# EAGLE schematic EPaperDisplayUnit (EAGLE 7.4.0)
GCN: 1.0; PCBNAME: EPaperDisplayUnit; PROJECT: EPaperDisplayUnit

## Sheet 1 of 2
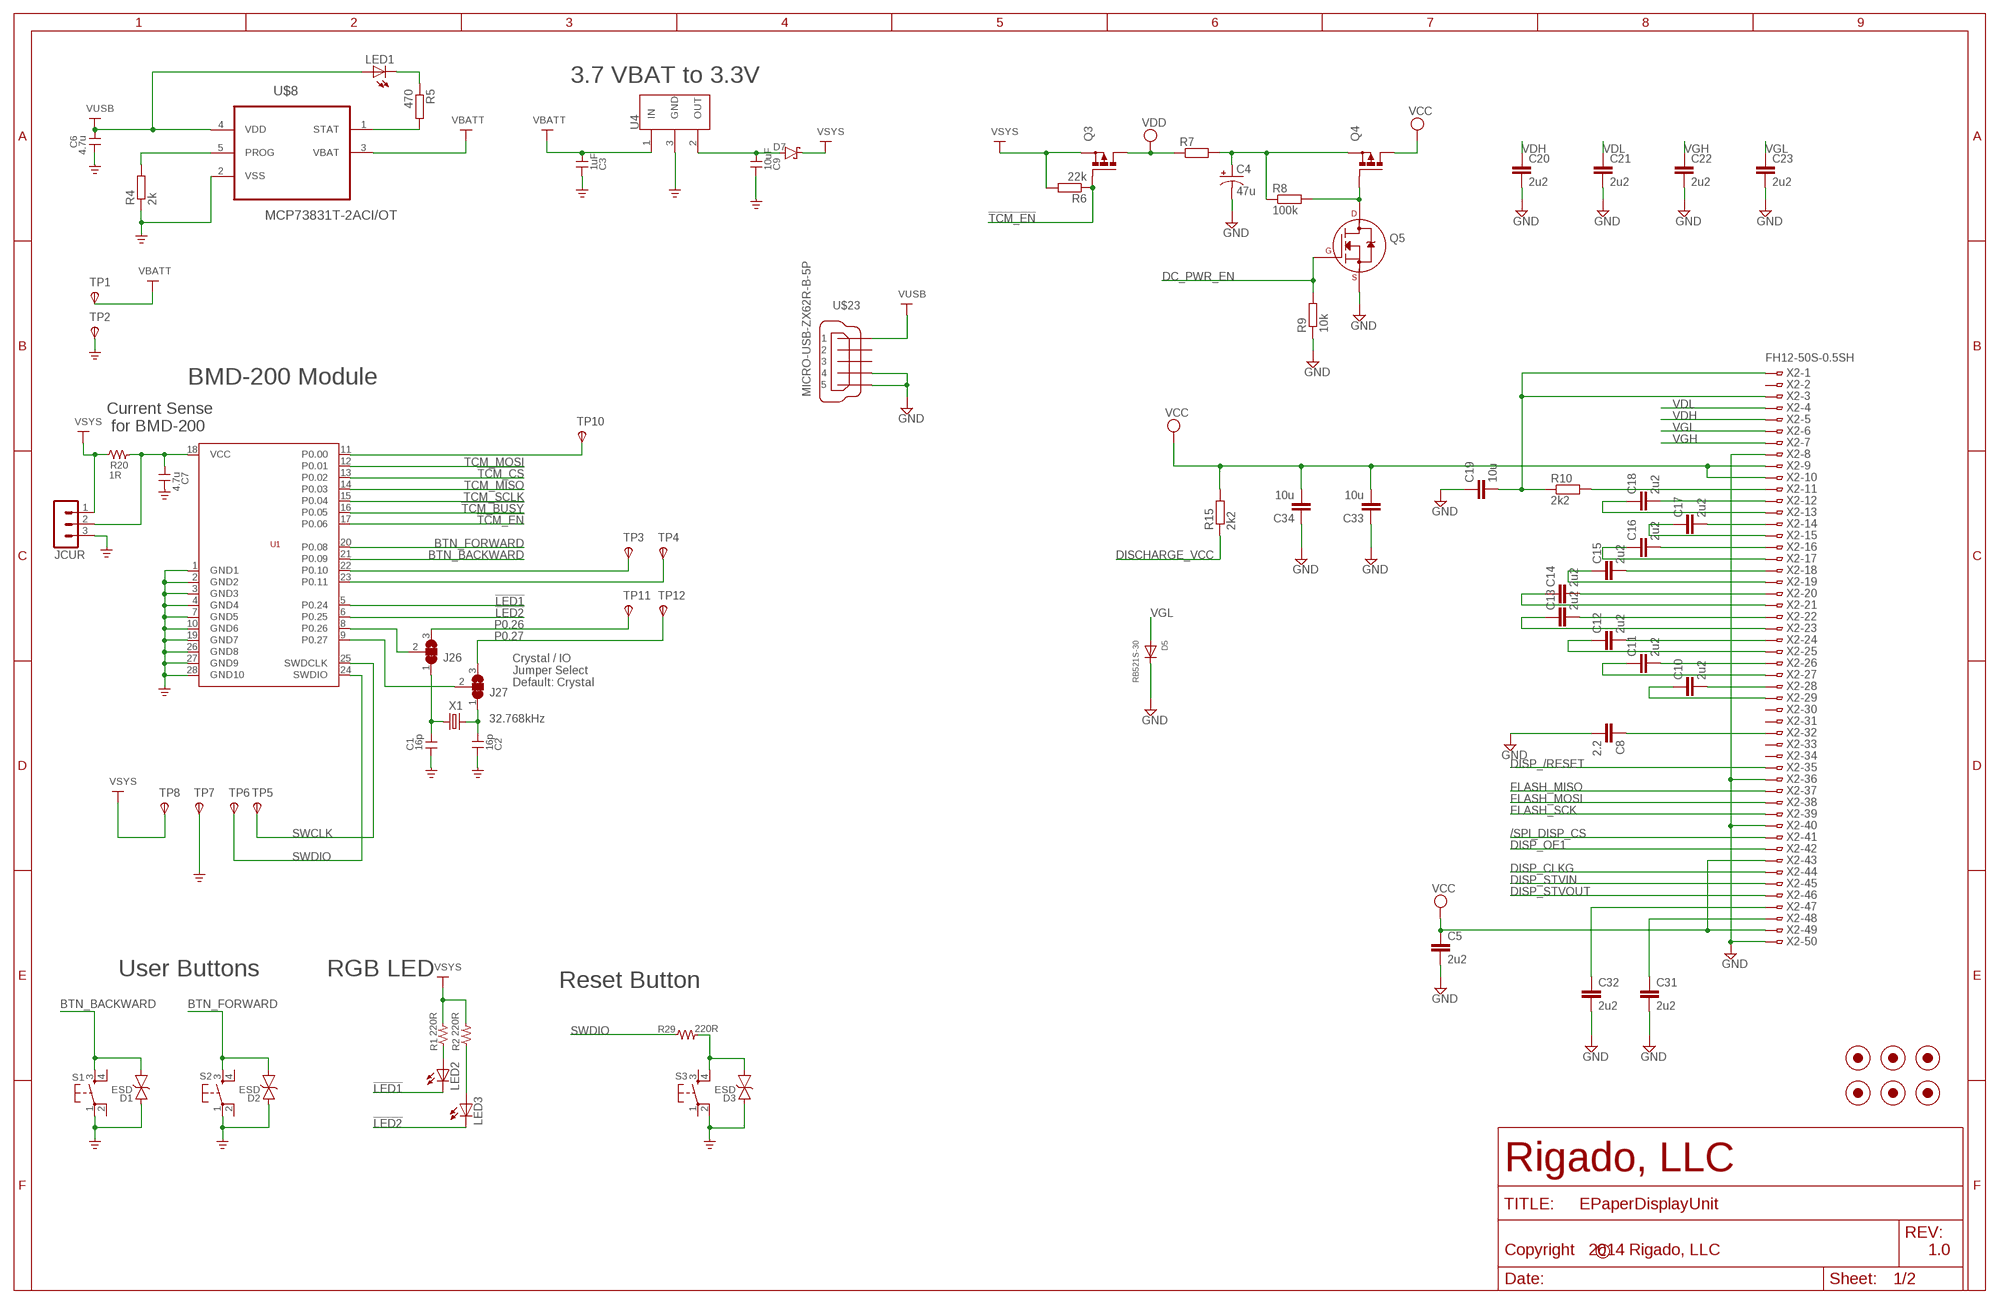
[diagram p0: schematic, sheet 1]

### Parts
C1  16p  C-0402  [SMD0402]
C2  16p  C-0402  [SMD0402]
C3  1uF  C-0402  [SMD0402]
C4  47u  CPOL-USB/3528-21R  [B/3528-21R]
C5  2u2  C-EUC0603  [C0603]
C6  4.7u  C-0603  [SMD0603]
C7  4.7u  C-0603  [SMD0603]
C8  2.2  C-EUC0603  [C0603]
C9  10uF  C-0402  [SMD0402]
C10  2u2  C-EUC1608  [C1608]
C11  2u2  C-EUC1608  [C1608]
C12  2u2  C-EUC1608  [C1608]
C13  2u2  C-EUC1608  [C1608]
C14  2u2  C-EUC1608  [C1608]
C15  2u2  C-EUC1608  [C1608]
C16  2u2  C-EUC1608  [C1608]
C17  2u2  C-EUC1608  [C1608]
C18  2u2  C-EUC1608  [C1608]
C19  10u  C-EUC1608  [C1608]
C20  2u2  C-EUC1608  [C1608]
C21  2u2  C-EUC1608  [C1608]
C22  2u2  C-EUC1608  [C1608]
C23  2u2  C-EUC1608  [C1608]
C31  2u2  C-EUC1608  [C1608]
C32  2u2  C-EUC1608  [C1608]
C33  10u  C-EUC1608  [C1608]
C34  10u  C-EUC1608  [C1608]
D1  ESD  ESDSOD-923  [SOD-923]
D2  ESD  ESDSOD-923  [SOD-923]
D3  ESD  ESDSOD-923  [SOD-923]
D5  RB521S-30  DIODESOD-523  [SOD-523]
D7  D-SCHOTTKY-SOD-123  [SOD-123]
FID1  FIDUCIAL-.04  [FIDUCIAL-.04]
FID2  FIDUCIAL-.04  [FIDUCIAL-.04]
FID3  FIDUCIAL-.04  [FIDUCIAL-.04]
FID4  FIDUCIAL-.04  [FIDUCIAL-.04]
FID5  FIDUCIAL-.04  [FIDUCIAL-.04]
FID6  FIDUCIAL-.04  [FIDUCIAL-.04]
J26  SOLDER_JUMPER_2WAY-TRACE12  [SJ_2WAY_TRACE]
J27  SOLDER_JUMPER_2WAY-TRACE12  [SJ_2WAY_TRACE]
JCUR  MA03-1SMT  [MA03-1-SMT]
LED1  LEDCHIPLED_0603  [CHIPLED_0603]
LED2  LEDCHIP-LED0603  [CHIP-LED0603]
LED3  LEDCHIP-LED0603  [CHIP-LED0603]
Q3  NTR4171PTG  [SOT23]
Q4  NTR4171PTG  [SOT23]
Q5  2N7002_SOT23  [SOT-23]
R1  220R  R-0402  [SMD0402]
R2  220R  R-0402  [SMD0402]
R4  2k  R-EU_R0402  [R0402]
R5  470  R-EU_R0402  [R0402]
R6  22k  R-EU_R0603  [R0603]
R7  R-EU_R0603  [R0603]
R8  100k  R-EU_R0603  [R0603]
R9  10k  R-EU_R0603  [R0603]
R10  2k2  R-EU_R0603  [R0603]
R15  2k2  R-EU_R0603  [R0603]
R20  1R  R-0805  [SMD0805]
R29  220R  R-0402  [SMD0402]
S1  10-XXTL3301-GW  [ESWITCH-TL3301-GW]
S2  10-XXTL3301-GW  [ESWITCH-TL3301-GW]
S3  10-XXTL3301-GW  [ESWITCH-TL3301-GW]
TP1  TPSPAD1-13Y  [P1-13Y]
TP2  TPSPAD1-13Y  [P1-13Y]
TP3  TPSPAD1-13Y  [P1-13Y]
TP4  TPSPAD1-13Y  [P1-13Y]
TP5  TPSPAD1-13Y  [P1-13Y]
TP6  TPSPAD1-13Y  [P1-13Y]
TP7  TPSPAD1-13Y  [P1-13Y]
TP8  TPSPAD1-13Y  [P1-13Y]
TP10  TPSPAD1-13Y  [P1-13Y]
TP11  TPSPAD1-13Y  [P1-13Y]
TP12  TPSPAD1-13Y  [P1-13Y]
U1  BMD-200  [BMD-200]
U4  VREG-SOT23  [SOT-23-3]
U$8  MCP73831T-2ACI/OT  [SOT95P280X145-5N]
U$23  MICRO-USB-ZX62R-B-5P  [ZX62R-B-5P]
X1  32.768kHz  CRYSTAL2SMD  [2SMD]
X2  FH12-50S-0.5SH  [FH12-50S-0.5SH]

### Nets
5V0: C6.1 LED1.A U$8.4(VDD) U$23.1 ; supply symbol labelled VUSB
!LED1: LED2.C U1.5(P0.24)
!LED2: LED3.C U1.6(P0.25)
!TCM_BUSY: U1.16(P0.05) ; also sheet 2
!TCM_CS: U1.13(P0.02) ; also sheet 2
!TCM_EN: Q3.G R6.1 U1.17(P0.06)
/SPI_DISP_CS: X2.41 ; also sheet 2
BTN_BACKWARD: D1.C S1.3(S) U1.21(P0.09)
BTN_FORWARD: D2.C S2.3(S) U1.20(P0.08)
DC_PWR_EN: Q5.1(G) R9.2 ; also sheet 2
DISCHARGE_VCC: R15.1 ; also sheet 2
DISP_/RESET: X2.35 ; also sheet 2
DISP_CLKG: X2.44 ; also sheet 2
DISP_OE1: X2.42 ; also sheet 2
DISP_STVIN: X2.45 ; also sheet 2
DISP_STVOUT: X2.46 ; also sheet 2
FLASH_MISO: X2.37 ; also sheet 2
FLASH_MOSI: X2.38 ; also sheet 2
FLASH_SCK: X2.39 ; also sheet 2
GND [Planes]: C1.1 C2.1 C3.1 C4.- C5.2 C6.2 C7.2 C8.2 C9.1 C19.1 C20.2 C21.2 C22.2 C23.2 C31.2 C32.2 C33.1 C34.1 D1.A D2.A D3.A D5.K(C) JCUR.3 Q5.2(S) R4.1 R9.1 S1.1(P) S2.1(P) S3.2(P1) TP2.TP(PP) TP7.TP(PP) U1.1(GND1) U1.2(GND2) U1.3(GND3) U1.4(GND4) U1.7(GND5) U1.10(GND6) U1.19(GND7) U1.26(GND8) U1.27(GND9) U1.28(GND10) U4.3(GND) U$8.2(VSS) U$23.4 U$23.5 X2.8 X2.36 X2.40 X2.50 ; also sheet 2
N$1: TP10.TP(PP) U1.11(P0.00)
N$3: J26.2 U1.8(P0.26)
N$4: C7.1 JCUR.2 R20.2 U1.18(VCC)
N$6: C9.2 D7.A U4.2(OUT)
N$7: R4.2 U$8.5(PROG)
N$8: LED1.C R5.1
N$9 [Planes]: C8.1 X2.32
N$10: R5.2 U$8.1(STAT)
N$11: Q4.G Q5.3(D) R8.2
N$12: C4.+ Q4.S R7.2 R8.1
N$13: C10.1 X2.29
N$14: C10.2 X2.28
N$15: C11.1 X2.27
N$16: C11.2 X2.26
N$17: C12.1 X2.25
N$18: C12.2 X2.24
N$19: C2.2 J27.1 X1.2
N$20: C1.2 J26.1 X1.1
N$21: C13.1 X2.23
N$22: C13.2 X2.22
N$23: J27.2 U1.9(P0.27)
N$24: C14.1 X2.21
N$25: C14.2 X2.20
N$26: C15.1 X2.19
N$27: C16.1 X2.17
N$28: C16.2 X2.16
N$29: C17.1 X2.15
N$30: C17.2 X2.14
N$31: C18.1 X2.13
N$32: C18.2 X2.12
N$33: LED2.A R1.1
N$34: LED3.A R2.1
N$36: C19.2 R10.1 X2.1 X2.3
N$37: R10.2 X2.11
N$38: TP3.TP(PP) U1.22(P0.10)
N$39: C15.2 X2.18
N$40: TP4.TP(PP) U1.23(P0.11)
N$47: D3.C R29.2 S3.4(S1)
N$48: R29.1
P0.26: J26.3 TP11.TP(PP)
P0.27: J27.3 TP12.TP(PP)
SWCLK: TP5.TP(PP) U1.25(SWDCLK)
SWDIO: TP6.TP(PP) U1.24(SWDIO)
TCM_MISO: U1.14(P0.03) ; also sheet 2
TCM_MOSI: U1.12(P0.01) ; also sheet 2
TCM_SCLK: U1.15(P0.04) ; also sheet 2
VBATT: C3.2 TP1.TP(PP) U4.1(IN) U$8.3(VBAT)
VCC: C5.1 C33.2 C34.2 Q4.D R15.2 X2.9 X2.10 X2.43 X2.49
VDD: Q3.D R7.1 ; also sheet 2
VDH: C20.1 X2.5
VDL: C21.1 X2.4
VGH: C22.1 C31.1 X2.7 X2.48
VGL: C23.1 C32.1 D5.A X2.6 X2.47
VSYS: D7.C JCUR.1 Q3.S R1.2 R2.2 R6.2 R20.1 TP8.TP(PP)
Unconnected: S1.2(P1) S1.4(S1) S2.2(P1) S2.4(S1) S3.1(P) S3.3(S) U$23.2 U$23.3 X2.2 X2.30 X2.31 X2.33 X2.34

### Notes on the sheet
- 3.7 VBAT to 3.3V
- BMD-200 Module
- Current Sense
   for BMD-200
- Crystal / IO
  Jumper Select
  Default: Crystal
- User Buttons | RGB LED
- Reset Button
- 1.0

## Sheet 2 of 2
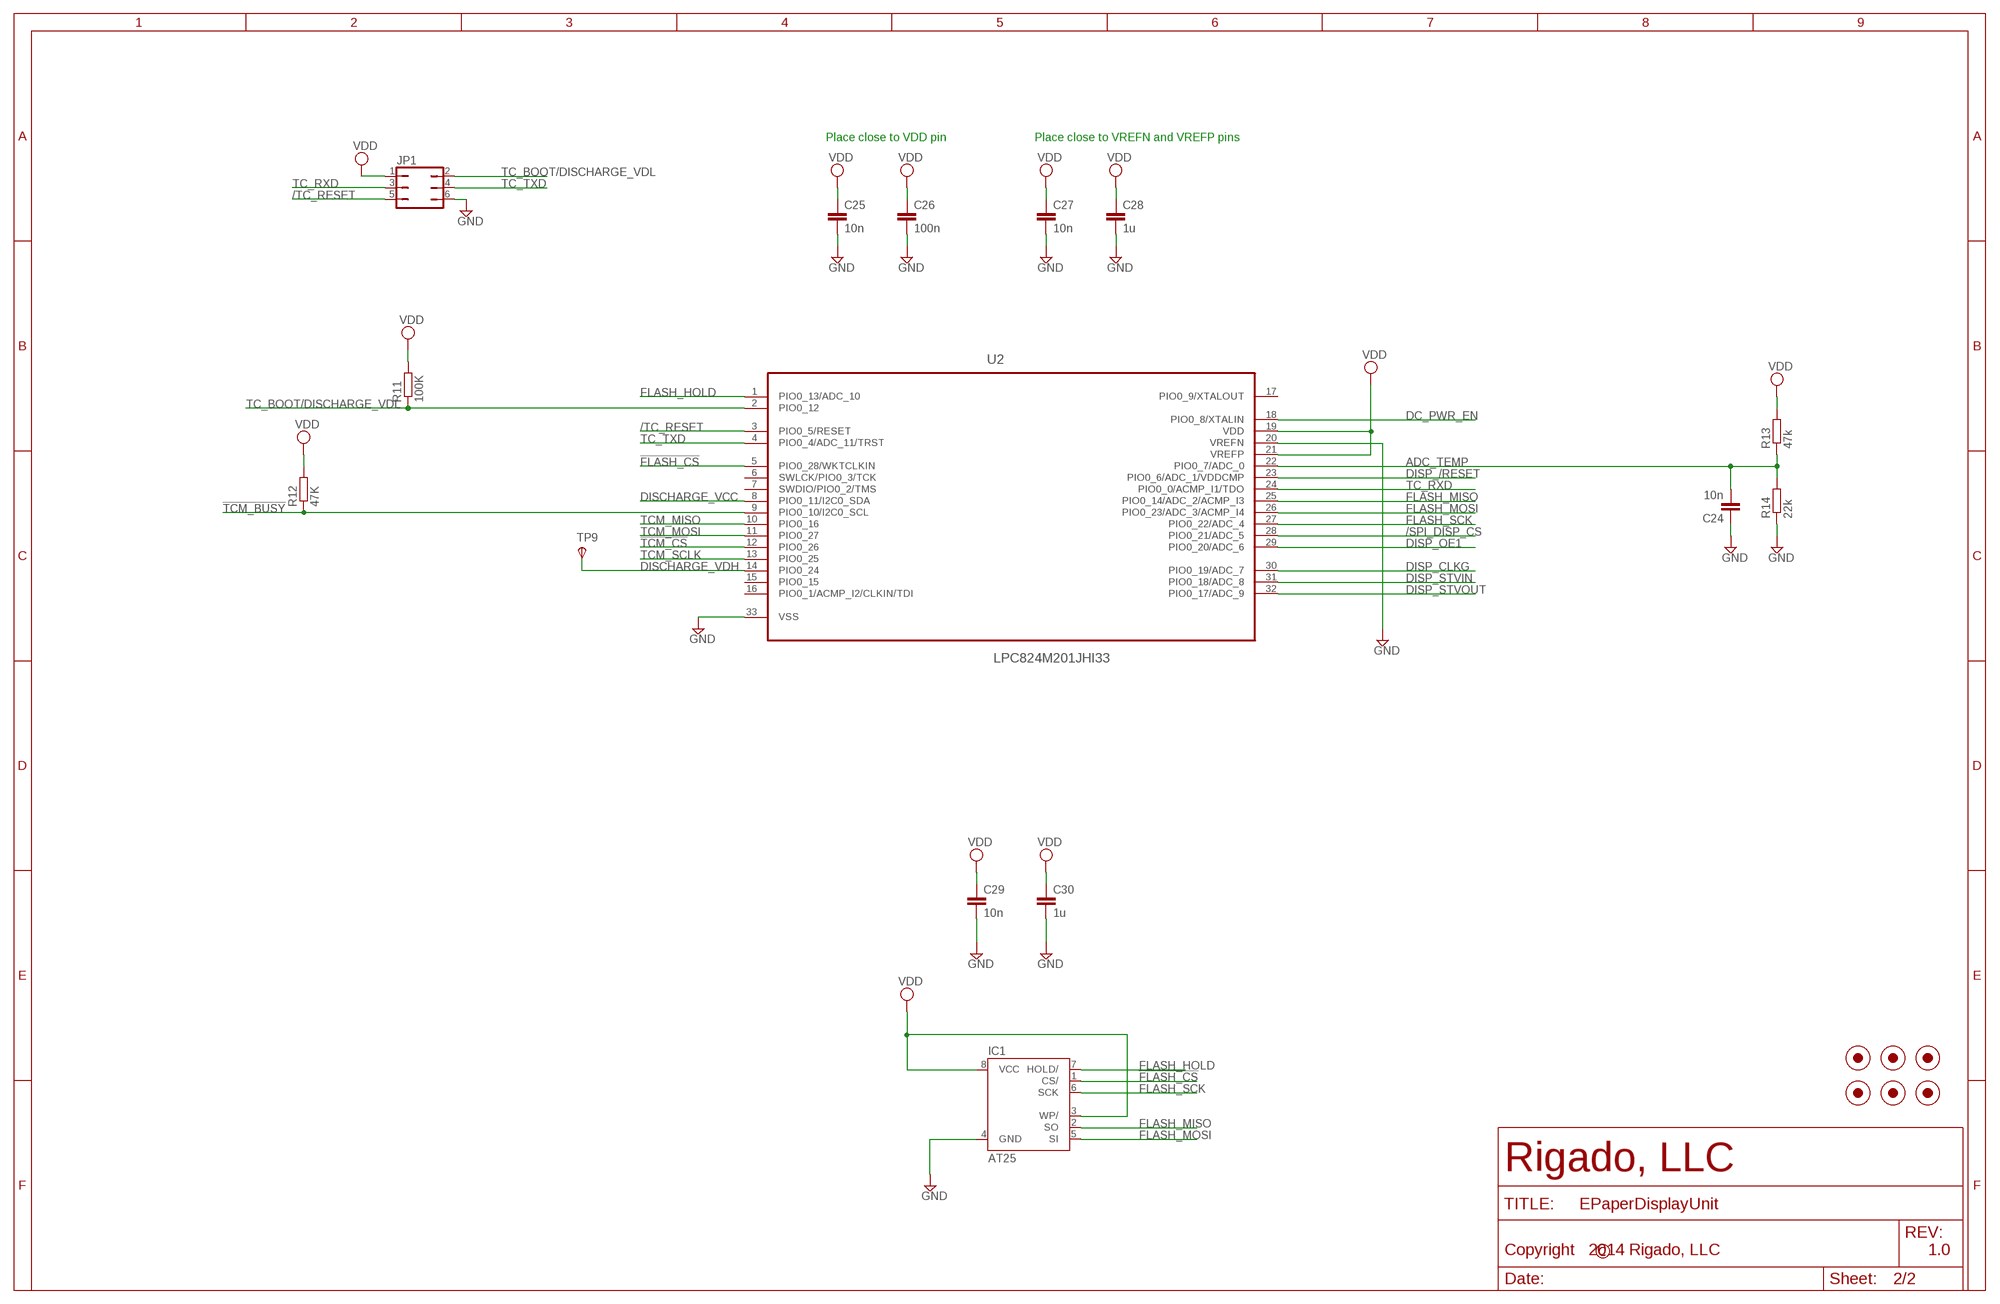
[diagram p1: schematic, sheet 2]

### Parts
C24  10n  C-EUC0603  [C0603]
C25  10n  C-EUC0603  [C0603]
C26  100n  C-EUC0603  [C0603]
C27  10n  C-EUC0603  [C0603]
C28  1u  C-EUC0603  [C0603]
C29  10n  C-EUC0603  [C0603]
C30  1u  C-EUC0603  [C0603]
FID7  FIDUCIAL-.04  [FIDUCIAL-.04]
FID8  FIDUCIAL-.04  [FIDUCIAL-.04]
FID9  FIDUCIAL-.04  [FIDUCIAL-.04]
FID10  FIDUCIAL-.04  [FIDUCIAL-.04]
FID11  FIDUCIAL-.04  [FIDUCIAL-.04]
FID12  FIDUCIAL-.04  [FIDUCIAL-.04]
IC1  AT25  [SOIC8]
JP1  JP3Q  [JP3Q]
R11  100K  R-EU_R0603  [R0603]
R12  47K  R-EU_R0603  [R0603]
R13  47k  R-EU_R0603  [R0603]
R14  22k  R-EU_R0603  [R0603]
TP9  TPSPAD1-13Y  [P1-13Y]
U2  LPC824M201JHI33  [QFN65P700X700X100-33N]

### Nets
!FLASH_CS: IC1.1(CS/) U2.5(PIO0_28/WKTCLKIN)
!TCM_BUSY: R12.1 U2.9(PIO0_10/I2C0_SCL) ; also sheet 1
!TCM_CS: U2.12(PIO0_26) ; also sheet 1
/SPI_DISP_CS: U2.28(PIO0_21/ADC_5) ; also sheet 1
/TC_RESET: JP1.5 U2.3(PIO0_5/RESET)
ADC_TEMP: C24.2 R13.1 R14.2 U2.22(PIO0_7/ADC_0)
DC_PWR_EN: U2.18(PIO0_8/XTALIN) ; also sheet 1
DISCHARGE_VCC: U2.8(PIO0_11/I2C0_SDA) ; also sheet 1
DISCHARGE_VDH: TP9.TP(PP) U2.14(PIO0_24)
DISP_/RESET: U2.23(PIO0_6/ADC_1/VDDCMP) ; also sheet 1
DISP_CLKG: U2.30(PIO0_19/ADC_7) ; also sheet 1
DISP_OE1: U2.29(PIO0_20/ADC_6) ; also sheet 1
DISP_STVIN: U2.31(PIO0_18/ADC_8) ; also sheet 1
DISP_STVOUT: U2.32(PIO0_17/ADC_9) ; also sheet 1
FLASH_HOLD: IC1.7(HOLD/) U2.1(PIO0_13/ADC_10)
FLASH_MISO: IC1.2(SO) U2.25(PIO0_14/ADC_2/ACMP_I3) ; also sheet 1
FLASH_MOSI: IC1.5(SI) U2.26(PIO0_23/ADC_3/ACMP_I4) ; also sheet 1
FLASH_SCK: IC1.6(SCK) U2.27(PIO0_22/ADC_4) ; also sheet 1
GND [Planes]: C24.1 C25.2 C26.2 C27.2 C28.2 C29.2 C30.2 IC1.4(GND) JP1.6 R14.1 U2.20(VREFN) U2.33(VSS) ; also sheet 1
TC_BOOT/DISCHARGE_VDL: JP1.2 R11.1 U2.2(PIO0_12)
TC_RXD: JP1.3 U2.24(PIO0_0/ACMP_I1/TDO)
TC_TXD: JP1.4 U2.4(PIO0_4/ADC_11/TRST)
TCM_MISO: U2.10(PIO0_16) ; also sheet 1
TCM_MOSI: U2.11(PIO0_27) ; also sheet 1
TCM_SCLK: U2.13(PIO0_25) ; also sheet 1
VDD: C25.1 C26.1 C27.1 C28.1 C29.1 C30.1 IC1.3(WP/) IC1.8(VCC) JP1.1 R11.2 R12.2 R13.2 U2.19(VDD) U2.21(VREFP) ; also sheet 1
Unconnected: U2.6(SWLCK/PIO0_3/TCK) U2.7(SWDIO/PIO0_2/TMS) U2.15(PIO0_15) U2.16(PIO0_1/ACMP_I2/CLKIN/TDI) U2.17(PIO0_9/XTALOUT)

### Notes on the sheet
- Place close to VDD pin | Place close to VREFN and VREFP pins
- 1.0

## Library data of the parts
C1 C2 = c:C; DESCRIPTION: CAP CER 16PF 50V 5% NP0 0402; EACH: 0.003; MFPN: CL05C160JB5NCNC; MFR: Samsung; VEND: Digikey; VPN: 1276-1645-1-ND
C3 C9 = c:C; DESCRIPTION: CAP CER 1UF 6.3V 5% X5R 0402; EACH: 0.006; MFPN: CL05A105JQ5NNNC; MFR: Samsung; VEND: Digikey; VPN: 1276-1444-1-ND
C4 = adafruit:CPOL-US: POLARIZED CAPACITOR, American symbol
C5 C8 C10-C23 C25-C34 = rcl:C-EU: CAPACITOR, European symbol
C6 C7 = c:C; DESCRIPTION: CAP CER 4.7UF 6.3V 10% X5R 0603; EACH: 0.022; MFPN: GRM188R60J475KE19D; MFR: Murata; VEND: Digikey; VPN: 490-3297-1-ND
C24 = resistor:C-EU: CAPACITOR, European symbol
D1-D3 = d:ESD; DESCRIPTION: TVS DIODE 3.3VWM SOD923; EACH: 0.04234; MFPN: ESD9B3.3ST5G; MFR: On Semi; VEND: Digikey; VPN: ESD9B3.3ST5GOSCT-ND
D5 = adafruit:DIODE: Diode SMADIODE - SMA Surface Mount Package 20V 1A Schottky Diode Digikey: 641-1014-6-ND DO-1N4148 - Through Hole Small Current Diode SOD-123 20V 1 A (.5mV Vf) Schottky Diode - Digikey: MBRX120TPMSCT-ND SOD-323 10V 570mA (.38mV Vf, 3ns) Schottky Diode - Digikey: ZLLS410CT-ND SOD-523 30V 30mA Schottky Diode (RB751S-40TE61) - Digikey: RB751S-40TE61CT-ND SOT23-R/W - SOT23 Package (R = Solder Paste/Reflow Ovens, W = Hand-Soldering) BAT54Film 40V 300mA - Digikey: 497-7162-1-ND
D7 = d:D-SCHOTTKY; DESCRIPTION: DIODE SCHOTTKY 20V 0.5A SOD123; EACH: 0.0647; MFPN: MBR0520LT3G; MFR: ON Semi; VEND: Digikey; VPN: MBR0520LT3GOSCT-ND
FID1-FID12 = rigado-pcb:FIDUCIAL
IC1 = atmel:AT25*: SPI bus serial EEPROM
J26 J27 = rigado-connectors:SOLDER_JUMPER_2WAY
JCUR = rigado-connectors:MA03-1: PIN HEADER; DESCRIPTION: 3POS SIL VERTICAL SMT HEADER; EACH: 0.1408; MFPN: M20-8770342; MFR: Harwin; VEND: Digikey; VPN: 952-1951-ND
JP1 = jumper:JP3Q: JUMPER
LED1-LED3 = led:LED: LED OSRAM: - CHIPLED LG R971, LG N971, LY N971, LG Q971, LY Q971, LO R971, LY R971 LH N974, LH R974 LS Q976, LO Q976, LY Q976 LO Q996 - Hyper CHIPLED LW Q18S LB Q993, LB Q99A, LB R99A - SideLED LS A670, LO A670, LY A670, LG A670, LP A670 LB A673, LV A673, LT A673, LW A673 LH A674 LY A675 LS A676, LA A676, LO A676, LY A676, LW A676 LS A679, LY A679, LG A679 - Hyper Micro SIDELED® LS Y876, LA Y876, LO Y876, LY Y876 LT Y87S - SmartLED LW L88C, LW L88S LB L89C, LB L89S, LG L890 LS L89K, LO L89K, LY L89K LS L896, LA L896, LO L896, LY L896 - TOPLED LS T670, LO T670, LY T670, LG T670, LP T670 LSG T670, LSP T670, LSY T670, LOP T670, LYG T670 LG T671, LOG T671, LSG T671 LB T673, LV T673, LT T673, LW T673 LH T674 LS T676, LA T676, LO T676, LY T676, LB T676, LH T676, LSB T676, LW T676 LB T67C, LV T67C, LT T67C, LS T67K, LO T67K, LY T67K, LW E67C LS E67B, LA E67B, LO E67B, LY E67B, LB E67C, LV E67C, LT E67C LW T67C LS T679, LY T679, LG T679 LS T770, LO T770, LY T770, LG T770, LP T770 LB T773, LV T773, LT T773, LW T773 LH T774 LS E675, LA E675, LY E675, LS T675 LS T776, LA T776, LO T776, LY T776, LB T776 LHGB T686 LT T68C, LB T68C - Hyper Mini TOPLED® LB M676 - Mini TOPLED Santana® LG M470 LS M47K, LO M47K, LY M47K Source: http://www.osram.convergy.de LUXEON: - LUMILED® LXK2-PW12-R00, LXK2-PW12-S00, LXK2-PW14-U00, LXK2-PW14-V00 LXK2-PM12-R00, LXK2-PM12-S00, LXK2-PM14-U00 LXK2-PE12-Q00, LXK2-PE12-R00, LXK2-PE12-S00, LXK2-PE14-T00, LXK2-PE14-U00 LXK2-PB12-K00, LXK2-PB12-L00, LXK2-PB12-M00, LXK2-PB14-N00, LXK2-PB14-P00, LXK2-PB14-Q00 LXK2-PR12-L00, LXK2-PR12-M00, LXK2-PR14-Q00, LXK2-PR14-R00 LXK2-PD12-Q00, LXK2-PD12-R00, LXK2-PD12-S00 LXK2-PH12-R00, LXK2-PH12-S00 LXK2-PL12-P00, LXK2-PL12-Q00, LXK2-PL12-R00 Source: www.luxeon.com KINGBRIGHT: KA-3528ASYC Source: www.kingbright.com
Q3 Q4 = transistor-power:NTR4171PTG: Power MOSFET P-Channel
Q5 = transistors:2N700*: 2N7000, 2N7002, NDS7002A N-channel enhancement mode MOSFET
R1 R2 = r:R; DESCRIPTION: RES 220 OHM 1/16W 5% 0402; EACH: 0.0023; MFPN: RC1005J221CS; MFR: Samsung; VEND: Digikey; VPN: 1276-4360-1-ND
R4-R6 R11 R13 R14 = resistor:R-EU_: RESISTOR, European symbol
R7-R10 R12 R15 = rcl:R-EU_: RESISTOR, European symbol
R20 = r:R; DESCRIPTION: RES 1.00 OHM 1/8W 1% 0805 SMD; EACH: 0.00513; MFPN: RC0805FR-071RL; MFR: Yageo; VEND: Digikey; VPN: 311-1.00CRCT-ND
R29 = r:R; DESCRIPTION: RES 220 OHM 1/16W 5% 0405; EACH: 0.0023; MFPN: RC1005J221CS; MFR: Samsung; VEND: Digikey; VPN: 1276-4360-1-ND
S1-S3 = rigado-switches:10-XX: Tact. Switch; DESCRIPTION: SWITCH TACTILE SPST-NO 0.05A 12V; EACH: 0.231; MFPN: TL3301AF160QG; MFR: E-Switch; VEND: Digikey; VPN: EG2526TR-ND
TP1-TP12 = testpad:TPS: TEST PIN
U1 = BMD-200:BMD-200; DESCRIPTION: BLE Module w/ nRF51822 SoC; MFPN: BMD-200; MFR: Rigado
U2 = NXP_By_element14_Batch_1:LPC824M201JHI33: 32-bit ARM Cortex-M0 microcontroller up to 32 kB flash and 8 kB SRAM; MPN: LPC1114FHN33/201,5; OC_FARNELL: -; OC_NEWARK: 70R5584; PACKAGE: HVQFN-32; SUPPLIER: NXP
U4 = rigado-power:VREG: Low Drop Linear Regulator; DESCRIPTION: IC REG LDO 3.3V 0.3A SOT23-3; EACH: 0.144; MFPN: AP7333-33SAG-7; MFR: Diodes Incorporated; VEND: Digikey; VPN: AP7333-33SAG-7DICT-ND
U$8 = MICROCHIP-MCP73831T:MCP73831T-2ACI/OT: Charge Management Controller; MPN: MCP73831T-2ACI/OT; OC_FARNELL: 1332158; OC_NEWARK: 56K7045; PACKAGE: SOT-5; SUPPLIER: Microchip
U$23 = con-hirose:MICRO-USB-: Hirose Micro USB Connector ZX62R-B-5P: Micro B, reverse (top mount) shell SMT Supplier: DigiKey H11574CT-ND Source: http://www.hirose.co.jp/cataloge_hp/e24200011.pdf
X1 = rigado-crystal:CRYSTAL: CRYSTAL; DESCRIPTION: CRYSTAL 32.768KHZ 12.5PF SMD; EACH: 0.36; MFPN: ST3215SB32768H5HPWAA; MFR: AVX; VEND: Digikey; VPN: 478-5428-1-ND
X2 = con-hirose:FH12-50S-0.5S: 0.5mm Pitch Connectors For FPC/FFC Source: Data sheet <http://www.hirose.co.jp/cataloge_hp/e58605370.pdf>; MPN: FH12-50S-0.5SH(55); OC_FARNELL: 1324557; OC_NEWARK: 34M6181

## Net classes
1 usb: width 0.356 mm, clearance 0.254 mm to class 0
6 Planes: clearance 0.508 mm to class 1